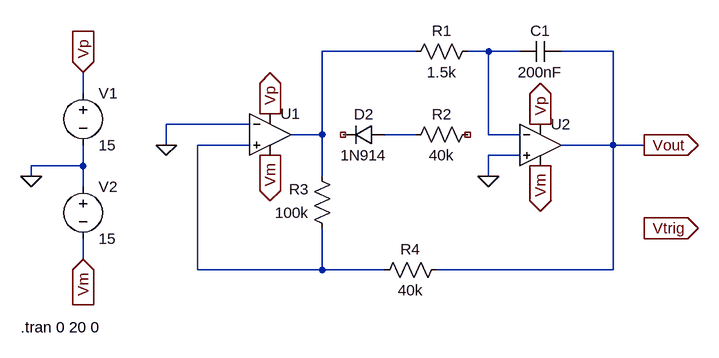
[diagram p0: schematic Opamp-Sawtooth-Oscillator.asc]
Opamp-Sawtooth-Oscillator.asc, the LTspice schematic file:
Version 4
SHEET 1 880 680
WIRE 352 16 208 16
WIRE 464 16 432 16
WIRE 512 16 464 16
WIRE 656 16 576 16
WIRE -160 80 -160 48
WIRE 96 128 -32 128
WIRE 208 144 208 16
WIRE 208 144 160 144
WIRE 352 144 304 144
WIRE 464 144 464 16
WIRE 512 144 464 144
WIRE -32 160 -32 128
WIRE 96 160 16 160
WIRE 656 160 656 16
WIRE 656 160 576 160
WIRE 704 160 656 160
WIRE 512 176 464 176
WIRE -160 192 -160 160
WIRE -160 192 -240 192
WIRE -240 208 -240 192
WIRE 208 208 208 144
WIRE 464 208 464 176
WIRE -160 224 -160 192
WIRE -160 336 -160 304
WIRE 16 352 16 160
WIRE 208 352 208 288
WIRE 208 352 16 352
WIRE 304 352 208 352
WIRE 656 352 656 160
WIRE 656 352 384 352
FLAG -240 208 0
FLAG 704 160 Vout
IOPIN 704 160 Out
FLAG 704 288 Vtrig
IOPIN 704 288 Out
FLAG -160 48 Vp
IOPIN -160 48 In
FLAG -160 336 Vm
IOPIN -160 336 In
FLAG 128 112 Vp
IOPIN 128 112 Out
FLAG 128 176 Vm
IOPIN 128 176 Out
FLAG 544 192 Vm
IOPIN 544 192 Out
FLAG 544 128 Vp
IOPIN 544 128 Out
FLAG 464 208 0
FLAG -32 160 0
SYMBOL diode 304 128 R90
WINDOW 0 0 32 VBottom 2
WINDOW 3 32 32 VTop 2
SYMATTR InstName D2
SYMATTR Value 1N914
SYMBOL res 448 128 R90
WINDOW 0 0 56 VBottom 2
WINDOW 3 32 56 VTop 2
SYMATTR InstName R2
SYMATTR Value 40k
SYMBOL res 448 0 R90
WINDOW 0 0 56 VBottom 2
WINDOW 3 32 56 VTop 2
SYMATTR InstName R1
SYMATTR Value 1.5k
SYMBOL cap 576 0 R90
WINDOW 0 0 32 VBottom 2
WINDOW 3 32 32 VTop 2
SYMATTR InstName C1
SYMATTR Value 200nF
SYMBOL res 400 336 R90
WINDOW 0 0 56 VBottom 2
WINDOW 3 32 56 VTop 2
SYMATTR InstName R4
SYMATTR Value 40k
SYMBOL voltage -160 64 R0
WINDOW 123 0 0 Left 0
WINDOW 39 0 0 Left 0
SYMATTR InstName V1
SYMATTR Value 15
SYMBOL voltage -160 208 R0
WINDOW 123 0 0 Left 0
WINDOW 39 0 0 Left 0
SYMATTR InstName V2
SYMATTR Value 15
SYMBOL res 224 304 R180
WINDOW 0 36 76 Left 2
WINDOW 3 36 40 Left 2
SYMATTR InstName R3
SYMATTR Value 100k
SYMBOL OpAmps\\UniversalOpAmp 128 144 R0
SYMATTR InstName U1
SYMBOL OpAmps\\UniversalOpAmp 544 160 R0
SYMATTR InstName U2
TEXT -256 440 Left 2 !.tran 0 20 0

The netlist it stands for:
* Opamp-Sawtooth-Oscillator.asc
D2 N003 NC_01 1N914
R2 NC_02 N003 40k
R1 N002 N001 1.5k
C1 Vout N002 200nF
R4 Vout N004 40k
V1 Vp 0 15
V2 0 Vm 15
R3 N004 N001 100k
XU1 N004 0 Vp Vm N001 level1 Avol=1Meg GBW=10Meg Vos=0 En=0 Enk=0 In=0 Ink=0 Rin=500Meg  ; pins In+ In- V+ V- OUT
XU2 0 N002 Vp Vm Vout level1 Avol=1Meg GBW=10Meg Vos=0 En=0 Enk=0 In=0 Ink=0 Rin=500Meg  ; pins In+ In- V+ V- OUT
.model D D
.lib standard.dio
.tran 0 20 0
.lib UniversalOpAmp1.lib
.backanno
.end